# EasyEDA Pro project ch552gv1.eprj

# Schematic CH552GV1
Create Date: 2023-10-27; Page Name: CH552GV1; Project Name: ch552gv1; Schematic Name: CH552GV1; Update Date: 2024-03-25; Company: 嘉立创EDA; Page Size: A4; Version: V1.0
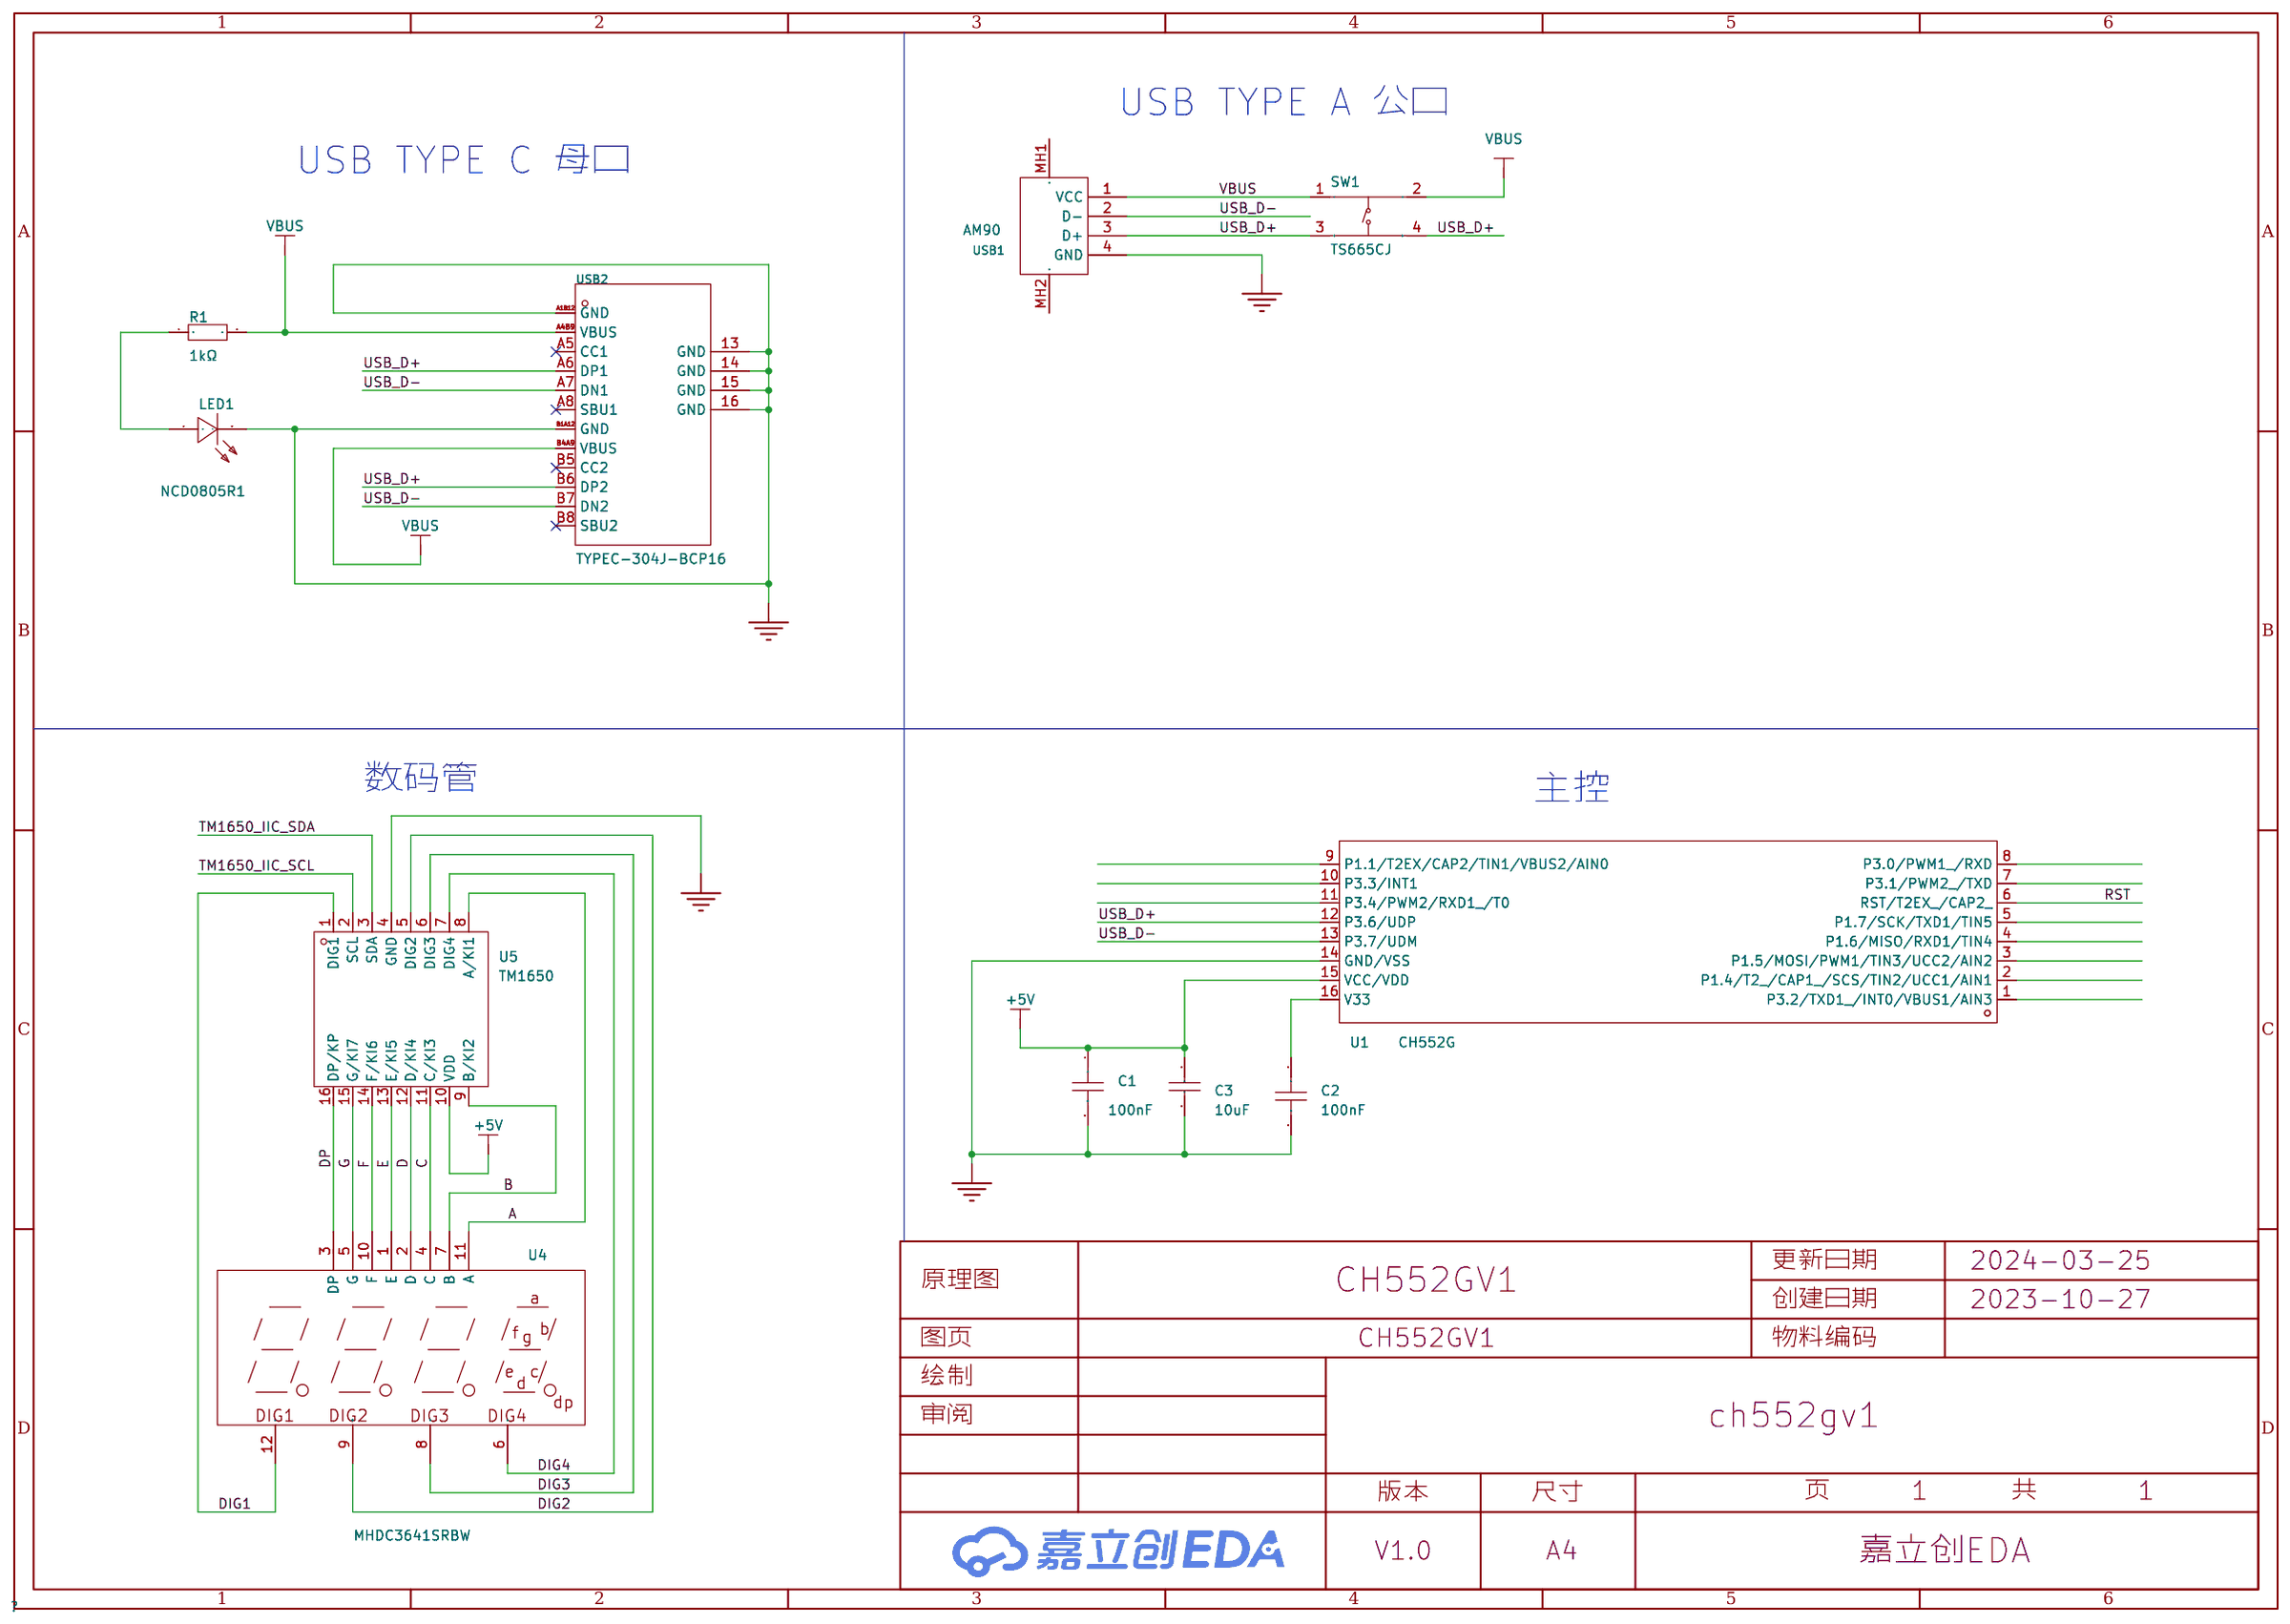
[diagram p0: schematic sheet]

## Parts
C1  100nF  [C0603]
C2  100nF  [C0603]
C3  10uF  [C1206]
LED1  NCD0805R1  [LED0805-R-RD]
R1  1kΩ  [R0603]
SW1  TS665CJ  [SW-TH_4P-L6.0-W6.0-P4.50-LS6.5]
U1  CH552G  [SOP-16_L10.0-W3.9-P1.27-LS6.0-BL]
U4  MHDC3641SRBW  [LED-SEG-TH_12P-L30.0-W14.0-P2.54-LS10.2]
U5  TM1650  [SOP-16_L10.0-W3.9-P1.27-LS6.0-BL]
USB1  AM90  [USB-AM-TH_AM90]
USB2  TYPEC-304J-BCP16  [USB-C-SMD_TYPEC-304J-BCP16]

## Library data of the parts
C1 C2 = CC0603KRX7R9BB104: 容值:100nF;精度:±10%;额定电压:50V;材质(温度系数):X7R;; LCSC Part Name: 100nF ±10% 50V; Supplier Part: C14663; Manufacturer: YAGEO(国巨); Supplier Footprint: 0603; JLCPCB Part Class: 基础库; Datasheet: https://atta.szlcsc.com/upload/public/pdf/source/20180910/C282072_33301C7F631E79921B82A8DAC6BCC5B3.pdf; Supplier: LCSC; Tolerance: ±10%; Voltage Rated: 50V; Temperature Coefficient: X7R
C3 = CL31A106KAHNNNE: 容值:10uF;精度:±10%;额定电压:25V;材质(温度系数):X5R;; LCSC Part Name: 10uF ±10% 25V; Supplier Part: C9807; Manufacturer: SAMSUNG(三星); Supplier Footprint: 1206; JLCPCB Part Class: 扩展库; Datasheet: https://atta.szlcsc.com/upload/public/pdf/source/20160218/1457707763339.pdf; Supplier: LCSC; Tolerance: ±10%; Voltage Rated: 25V; Temperature Coefficient: X5R
LED1 = NCD0805R1: 灯头类型:-;发光颜色:红色;正向电压(VF):1.6V~2.6V;功率:65mW;正向电流:20mA;主波长:615nm~630nm;二极管配置:独立二极管;透镜颜色:无色透明透镜;色温:-;发光强度:67mcd~195mcd;发光角度:130°;载带方式:-;工作温度:-30℃~+85℃;; Supplier Part: C84256; Manufacturer: 国星光电; Supplier Footprint: 0805; JLCPCB Part Class: 基础库; Datasheet: https://atta.szlcsc.com/upload/public/pdf/source/20200820/C84256_F0A75A43B3EAD75808600A0514C76B99.pdf; Supplier: LCSC; Emitted Color: 红色; Forward Voltage (VF): 1.6V~2.6V; Power Dissipation: 65mW; Forward Current: 20mA; Dominant Wavelength: 615nm~630nm; Diode Configuration: 独立二极管; Lens Color: 无色透明透镜; Luminous Intensity: 67mcd~195mcd; Viewing Angle: 130°; Operating Temperature: -30℃~+85℃
R1 = 0603WAF1001T5E: 电阻类型:厚膜电阻;阻值:1kΩ;精度:±1%;功率:100mW;最大工作电压:75V;温度系数:±100ppm/℃;; LCSC Part Name: 1kΩ ±1% 100mW 厚膜电阻; Supplier Part: C21190; Manufacturer: UNI-ROYAL(厚声); Supplier Footprint: 0603; JLCPCB Part Class: 基础库; Datasheet: https://atta.szlcsc.com/upload/public/pdf/source/20200306/C422600_1E6D84923E4A46A82E41ADD87F860B5C.pdf; Supplier: LCSC; Type: 厚膜电阻; Tolerance: ±1%; Power(Watts): 100mW; Overload Voltage (Max): 75V; Temperature Coefficient: ±100ppm/℃; Operating Temperature Range: -55℃~+155℃
SW1 = TS665CJ: 触点电流:50mA;额定电压(DC):12V;电路结构:单刀单掷;安装方式:直插;带灯:-;机械寿命:-;; LCSC Part Name: 6*6*5mm 直插 轻触开关; Supplier Part: C393938; Manufacturer: SHOU HAN(首韩); Supplier Footprint: 插件; JLCPCB Part Class: 扩展库; Datasheet: https://atta.szlcsc.com/upload/public/pdf/source/20190521/C393938_BDABEAC600B4C55E200A80AA129B70BC.pdf; Supplier: LCSC; Contact Current: 50mA; Voltage Rating (DC): 12V; Circuit: 单刀单掷; Mounting Style: 直插; Actuator Style: 圆形按钮; Switch Length: 6mm; Switch Width: 6mm; Switch Height: 5mm
U1 = CH552G: CPU内核:51系列;CPU最大主频:24MHz;工作电压范围:3.3V~5V;程序存储容量:16KB;程序存储器类型:FLASH;RAM总容量:1.25KB;GPIO端口数量:-;; Supplier Part: C111292; Manufacturer: WCH(南京沁恒); Supplier Footprint: SOP-16; JLCPCB Part Class: 扩展库; Datasheet: https://atta.szlcsc.com/upload/public/pdf/source/20200819/C111292_2988E0DDEDF937C7B5A075A68BF2AC9C.pdf; Supplier: LCSC; CPU Core: 51系列; CPU Maximum Speed: 24MHz; Operating Voltage Range: 3.3V~5V; Program Storage Size: 16KB; Program Memory Type: FLASH; RAM Size: 1.25KB; ADC (Bit): 8bit; PWM (Bit): 8bit; 16Bit Timer: 3; UART/USART: 2; SPI: 1; Universal Serial Bus: 有; Peripheral/Function: DMA；看门狗；CCP捕获/比较；触控按键; Watchdog: 有; CCP Capture/Compare: 有; Direct Memory Access: 有; Internal Oscillator: 有; Operating Temperature Range: -40℃~+85℃
U4 = MHDC3641SRBW: 数码管位数:4位;功耗:50mW;发光颜色:红色;LED极性:共阴极;数字/字母大小(英寸):0.362;; LCSC Part Name: 0.36共阴四八红色数码管; Supplier Part: C3291494; Manufacturer: MEIHUA(美华); Supplier Footprint: 插件; JLCPCB Part Class: 扩展库; Datasheet: https://atta.szlcsc.com/upload/public/pdf/source/20220627/BF0C2CD628B0CAC5A0500BAA2D144DD2.pdf; Supplier: LCSC; Number of Characters: 4位; Module Size: 30.0mmx14mmx7.2mm; Power Dissipation: 50mW; Luminous Color: 红色; LED Polarity: 共阴极; Digit/Alpha Size(inch): 0.362
U5 = TM1650: 晶圆版本是TA1809B; LCSC Part Name: 晶圆版本是TA1809B; Supplier Part: C2685241; Manufacturer: TM(天微); Supplier Footprint: SOP-16; JLCPCB Part Class: 扩展库; Datasheet: https://atta.szlcsc.com/upload/public/pdf/source/20210512/C2685241_0A1DB6924EEA12E8A785A705958A55DE.pdf; Supplier: LCSC
USB1 = AM90: 连接器类型:Type-A;标准:USB 2.0;公母:公头;触点数量:4P;端口数量:1;安装方式:弯插;额定电流 - 电源:-;工作温度范围:-;; LCSC Part Name: Type-A 公头 弯插 白胶有柱 直边; Supplier Part: C404965; Manufacturer: SHOU HAN(首韩); Supplier Footprint: 插件; JLCPCB Part Class: 扩展库; Datasheet: https://atta.szlcsc.com/upload/public/pdf/source/20190722/C404965_9CC10BE28E3F9E5134758D030387C529.pdf; Supplier: LCSC; Connector Type: Type-A; Standard: USB 2.0; Gender: 公头; Number of Contacts: 4P; Number of Ports: 1; Mounting Style: 弯插
USB2 = TYPEC-304J-BCP16: 连接器类型:Type-C;标准:USB 3.1;公母:母座;触点数量:16;端口数量:1;安装方式:卧贴;额定电流 - 电源:5A;工作温度范围:-40℃~+85℃;焊接温度(最大值):260℃;; LCSC Part Name: Type-C 母座 卧贴 脚长2.0; Supplier Part: C2835315; Manufacturer: XUNPU(讯普); Supplier Footprint: SMD,8.94x7.35x3.16mm; JLCPCB Part Class: 扩展库; Datasheet: https://atta.szlcsc.com/upload/public/pdf/source/20210528/C2835315_A76BD3CF9329D12B6041421AD23BFD66.pdf; Supplier: LCSC; Connector Type: Type-C; Standard: USB 3.1; Gender: 母座; Number of Ports: 1; Number of Contacts: 16; Mounting Style: 卧贴; Current Rating - Power (Max): 5A; Operating Temperature Range: -40℃~+85℃; Soldering Temperature(Max): 260℃; Welding Temperature (Max): 260℃

## Nets
+5V: C1.1 C3.1 U1.15(VCC/VDD) U5.10(VDD)
GND: C1.2 C2.2 C3.2 LED1.2(-) U1.14(GND/VSS) U5.4(GND) USB1.4(GND) USB2.13(GND) USB2.14(GND) USB2.15(GND) USB2.16(GND) USB2.A1B12(GND) USB2.B1A12(GND)
VBUS: R1.2 SW1.1(A) SW1.2(B) USB1.1(VCC) USB2.A4B9(VBUS) USB2.B4A9(VBUS)
A: U4.11(A) U5.8(A/KI1)
B: U4.7(B) U5.9(B/KI2)
C: U4.4(C) U5.11(C/KI3)
D: U4.2(D) U5.12(D/KI4)
DIG1: U4.12(DIG1) U5.1(DIG1)
DIG2: U4.9(DIG2) U5.5(DIG2)
DIG3: U4.8(DIG3) U5.6(DIG3)
DIG4: U4.6(DIG4) U5.7(DIG4)
DP: U4.3(DP) U5.16(DP/KP)
E: U4.1(E) U5.13(E/KI5)
F: U4.10(F) U5.14(F/KI6)
G: U4.5(G) U5.15(G/KI7)
RST: U1.6(RST/T2EX_/CAP2_)
TM1650_IIC_SCL: U5.2(SCL)
TM1650_IIC_SDA: U5.3(SDA)
USB_D+: SW1.3(C) SW1.4(D) U1.12(P3.6/UDP) USB1.3(D+) USB2.A6(DP1) USB2.B6(DP2)
USB_D-: U1.13(P3.7/UDM) USB1.2(D-) USB2.A7(DN1) USB2.B7(DN2)
$1N1756: LED1.1(+) R1.1
Net-(C2-1): C2.1 U1.16(V33)

Not connected (* = marked no-connect by the designer): U1 1(P3.2/TXD1_/INT0/VBUS1/AIN3) 2(P1.4/T2_/CAP1_/SCS/TIN2/UCC1/AIN1) 3(P1.5/MOSI/PWM1/TIN3/UCC2/AIN2) 4(P1.6/MISO/RXD1/TIN4) 5(P1.7/SCK/TXD1/TIN5) 7(P3.1/PWM2_/TXD) 8(P3.0/PWM1_/RXD) 9(P1.1/T2EX/CAP2/TIN1/VBUS2/AIN0) 10(P3.3/INT1) 11(P3.4/PWM2/RXD1_/T0); USB1 MH1 MH2; USB2 A5(CC1)* A8(SBU1)* B5(CC2)* B8(SBU2)*

## Notes on the sheet
- USB TYPE A 公口
- USB TYPE C 母口
- 数码管
- 主控

# Schematic CH552GV2
Create Date: 2024-03-15; Page Name: P1; Project Name: ch552gv1; Schematic Name: CH552GV2; Update Date: 2024-03-18; Company: 嘉立创EDA; Page Size: A4; Version: V1.0
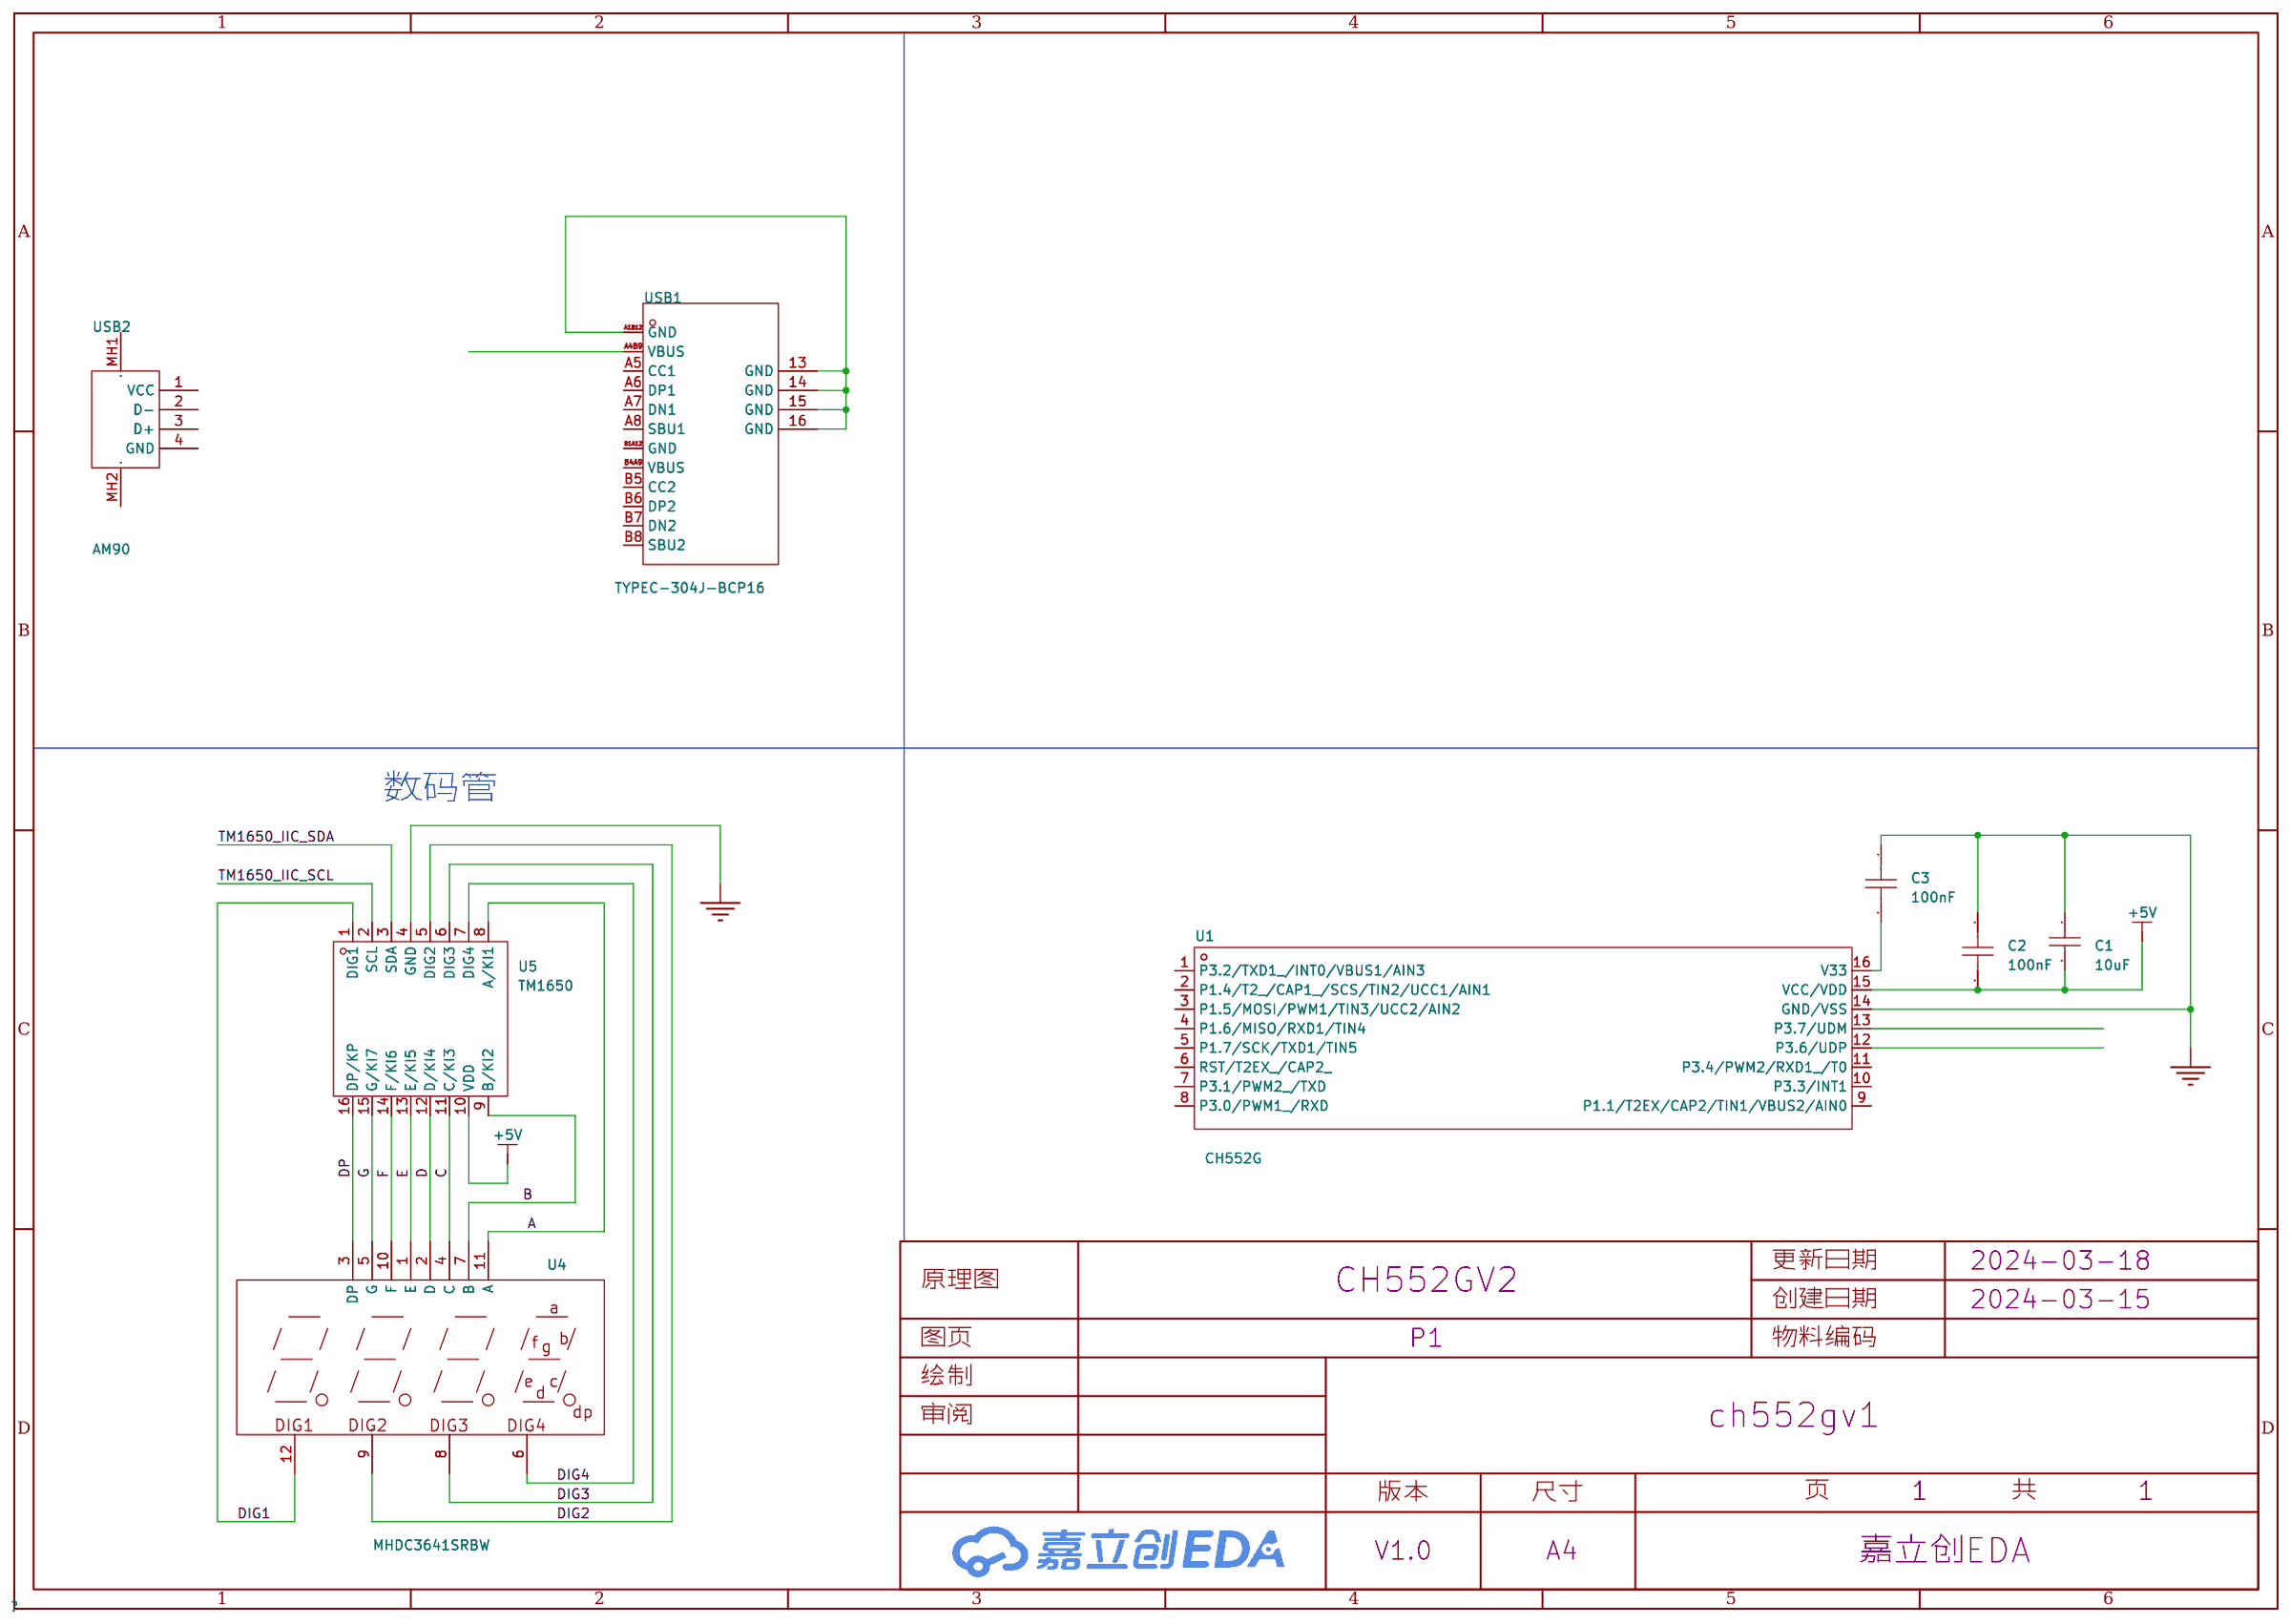
[diagram p1: schematic sheet]

## Parts
C1  10uF  [C1206]
C2  100nF  [C0603]
C3  100nF  [C0603]
U1  CH552G  [SOP-16_L10.0-W3.9-P1.27-LS6.0-BL]
U4  MHDC3641SRBW  [LED-SEG-TH_12P-L30.0-W14.0-P2.54-LS10.2]
U5  TM1650  [SOP-16_L10.0-W3.9-P1.27-LS6.0-BL]
USB1  TYPEC-304J-BCP16  [USB-C-SMD_TYPEC-304J-BCP16]
USB2  AM90  [USB-AM-TH_AM90]

## Library data of the parts
C1 = CL31A106KAHNNNE: 容值:10uF;精度:±10%;额定电压:25V;材质(温度系数):X5R;; LCSC Part Name: 10uF ±10% 25V; Supplier Part: C9807; Manufacturer: SAMSUNG(三星); Supplier Footprint: 1206; JLCPCB Part Class: 扩展库; Datasheet: https://atta.szlcsc.com/upload/public/pdf/source/20160218/1457707763339.pdf; Supplier: LCSC; Tolerance: ±10%; Voltage Rated: 25V; Temperature Coefficient: X5R
C2 C3 = CC0603KRX7R9BB104: 容值:100nF;精度:±10%;额定电压:50V;材质(温度系数):X7R;; LCSC Part Name: 100nF ±10% 50V; Supplier Part: C14663; Manufacturer: YAGEO(国巨); Supplier Footprint: 0603; JLCPCB Part Class: 基础库; Datasheet: https://atta.szlcsc.com/upload/public/pdf/source/20180910/C282072_33301C7F631E79921B82A8DAC6BCC5B3.pdf; Supplier: LCSC; Tolerance: ±10%; Voltage Rated: 50V; Temperature Coefficient: X7R
U1 = CH552G: CPU内核:51系列;CPU最大主频:24MHz;工作电压范围:3.3V~5V;程序存储容量:16KB;程序存储器类型:FLASH;RAM总容量:1.25KB;GPIO端口数量:-;; Supplier Part: C111292; Manufacturer: WCH(南京沁恒); Supplier Footprint: SOP-16; JLCPCB Part Class: 扩展库; Datasheet: https://atta.szlcsc.com/upload/public/pdf/source/20200819/C111292_2988E0DDEDF937C7B5A075A68BF2AC9C.pdf; Supplier: LCSC; CPU Core: 51系列; CPU Maximum Speed: 24MHz; Operating Voltage Range: 3.3V~5V; Program Storage Size: 16KB; Program Memory Type: FLASH; RAM Size: 1.25KB; ADC (Bit): 8bit; PWM (Bit): 8bit; 16Bit Timer: 3; UART/USART: 2; SPI: 1; Universal Serial Bus: 有; Peripheral/Function: DMA；看门狗；CCP捕获/比较；触控按键; Watchdog: 有; CCP Capture/Compare: 有; Direct Memory Access: 有; Internal Oscillator: 有; Operating Temperature Range: -40℃~+85℃
U4 = MHDC3641SRBW: 数码管位数:4位;功耗:50mW;发光颜色:红色;LED极性:共阴极;数字/字母大小(英寸):0.362;; LCSC Part Name: 0.36共阴四八红色数码管; Supplier Part: C3291494; Manufacturer: MEIHUA(美华); Supplier Footprint: 插件; JLCPCB Part Class: 扩展库; Datasheet: https://atta.szlcsc.com/upload/public/pdf/source/20220627/BF0C2CD628B0CAC5A0500BAA2D144DD2.pdf; Supplier: LCSC; Number of Characters: 4位; Module Size: 30.0mmx14mmx7.2mm; Power Dissipation: 50mW; Luminous Color: 红色; LED Polarity: 共阴极; Digit/Alpha Size(inch): 0.362
U5 = TM1650: 晶圆版本是TA1809B; LCSC Part Name: 晶圆版本是TA1809B; Supplier Part: C2685241; Manufacturer: TM(天微); Supplier Footprint: SOP-16; JLCPCB Part Class: 扩展库; Datasheet: https://atta.szlcsc.com/upload/public/pdf/source/20210512/C2685241_0A1DB6924EEA12E8A785A705958A55DE.pdf; Supplier: LCSC
USB1 = TYPEC-304J-BCP16: 连接器类型:Type-C;标准:USB 3.1;公母:母;端口数量:1;触点数量:16P;安装方式:卧贴;额定电流 - 电源:5A;工作温度范围:-40℃~+85℃;焊接温度(最大值):260℃;; LCSC Part Name: Type-C 母 卧贴; Supplier Part: C2835315; Manufacturer: XUNPU(讯普); Supplier Footprint: SMD; JLCPCB Part Class: 扩展库; Datasheet: https://atta.szlcsc.com/upload/public/pdf/source/20210528/C2835315_A76BD3CF9329D12B6041421AD23BFD66.pdf; Supplier: LCSC; Connector Type: Type-C; Standard: USB 3.1; Gender: 母; Number of Ports: 1; Number of Contacts: 16P; Mounting Style: 卧贴; Current Rating - Power (Max): 5A; Operating Temperature Range: -40℃~+85℃; Soldering Temperature(Max): 260℃
USB2 = AM90: 连接器类型:Type-A;标准:USB 2.0;公母:公头;触点数量:4P;端口数量:1;安装方式:弯插;额定电流 - 电源:-;工作温度范围:-;; LCSC Part Name: Type-A 公头 弯插 白胶有柱 直边; Supplier Part: C404965; Manufacturer: SHOU HAN(首韩); Supplier Footprint: 插件; JLCPCB Part Class: 扩展库; Datasheet: https://atta.szlcsc.com/upload/public/pdf/source/20190722/C404965_9CC10BE28E3F9E5134758D030387C529.pdf; Supplier: LCSC; Connector Type: Type-A; Standard: USB 2.0; Gender: 公头; Number of Contacts: 4P; Number of Ports: 1; Mounting Style: 弯插

## Nets
+5V: C1.2 C2.2 U1.15(VCC/VDD) U5.10(VDD)
GND: C1.1 C2.1 C3.1 U1.14(GND/VSS) U5.4(GND)
A: U4.11(A) U5.8(A/KI1)
B: U4.7(B) U5.9(B/KI2)
C: U4.4(C) U5.11(C/KI3)
D: U4.2(D) U5.12(D/KI4)
DIG1: U4.12(DIG1) U5.1(DIG1)
DIG2: U4.9(DIG2) U5.5(DIG2)
DIG3: U4.8(DIG3) U5.6(DIG3)
DIG4: U4.6(DIG4) U5.7(DIG4)
DP: U4.3(DP) U5.16(DP/KP)
E: U4.1(E) U5.13(E/KI5)
F: U4.10(F) U5.14(F/KI6)
G: U4.5(G) U5.15(G/KI7)
TM1650_IIC_SCL: U5.2(SCL)
TM1650_IIC_SDA: U5.3(SDA)
Net-(C3-2): C3.2 U1.16(V33)
Net-(USB1-13): USB1.13(GND) USB1.14(GND) USB1.15(GND) USB1.16(GND) USB1.A1B12(GND)

Not connected (* = marked no-connect by the designer): U1 1(P3.2/TXD1_/INT0/VBUS1/AIN3) 2(P1.4/T2_/CAP1_/SCS/TIN2/UCC1/AIN1) 3(P1.5/MOSI/PWM1/TIN3/UCC2/AIN2) 4(P1.6/MISO/RXD1/TIN4) 5(P1.7/SCK/TXD1/TIN5) 6(RST/T2EX_/CAP2_) 7(P3.1/PWM2_/TXD) 8(P3.0/PWM1_/RXD) 9(P1.1/T2EX/CAP2/TIN1/VBUS2/AIN0) 10(P3.3/INT1) 11(P3.4/PWM2/RXD1_/T0) 12(P3.6/UDP) 13(P3.7/UDM); USB1 A4B9(VBUS) A5(CC1) A6(DP1) A7(DN1) A8(SBU1) B1A12(GND) B4A9(VBUS) B5(CC2) B6(DP2) B7(DN2) B8(SBU2); USB2 1(VCC) 2(D-) 3(D+) 4(GND) MH1 MH2

## Notes on the sheet
- 数码管

# Schematic CH552TV1
Create Date: 2024-03-15; Page Name: P1; Project Name: ch552gv1; Schematic Name: CH552TV1; Update Date: 2024-03-16; Company: 嘉立创EDA; Page Size: A4; Version: V1.0
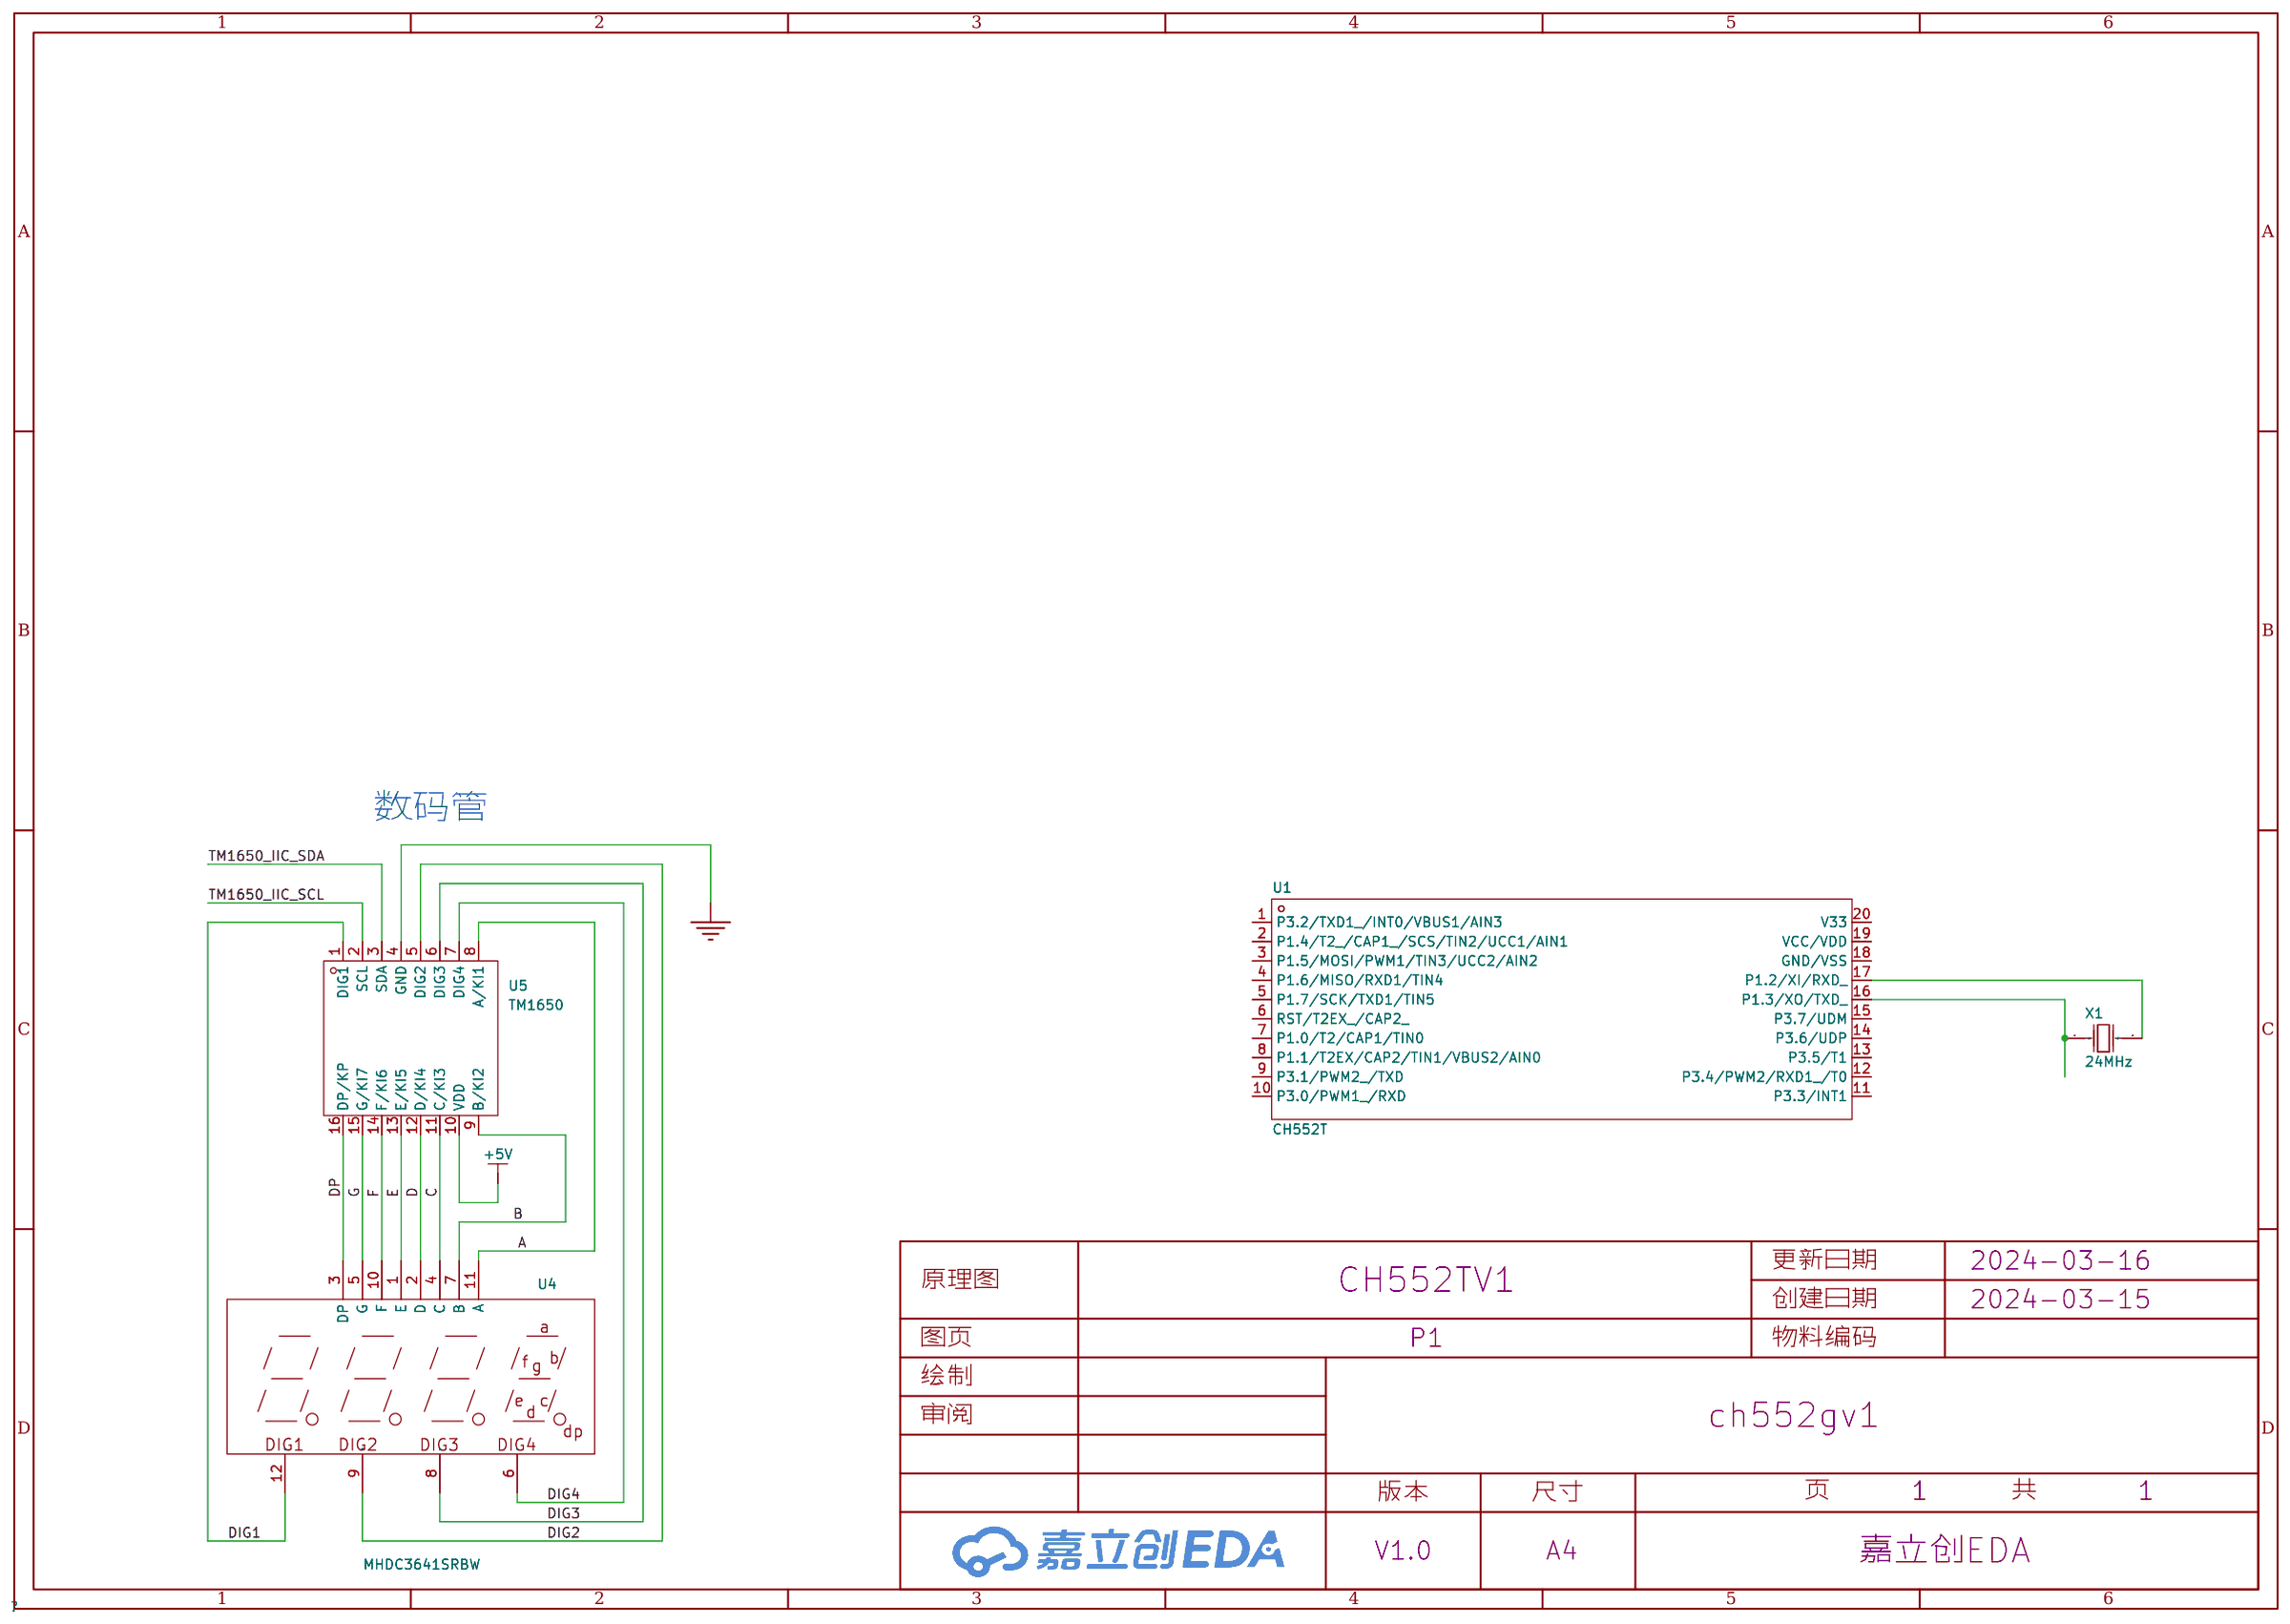
[diagram p2: schematic sheet]

## Parts
U1  CH552T  [TSSOP-20_L6.5-W4.4-P0.65-LS6.4-BL]
U4  MHDC3641SRBW  [LED-SEG-TH_12P-L30.0-W14.0-P2.54-LS10.2]
U5  TM1650  [SOP-16_L10.0-W3.9-P1.27-LS6.0-BL]
X1  24MHz  [HC-49S_L11.4-W4.8]

## Library data of the parts
U1 = CH552T: 应用功能:-;接口协议:-;; Supplier Part: C111367; Manufacturer: WCH(南京沁恒); Supplier Footprint: TSSOP-20; JLCPCB Part Class: 扩展库; Datasheet: https://atta.szlcsc.com/upload/public/pdf/source/20200819/C111367_8DB5755A3F0C96025C1473BE9B2CF47E.pdf; Supplier: LCSC
U4 = MHDC3641SRBW: 数码管位数:4位;功耗:50mW;发光颜色:红色;LED极性:共阴极;数字/字母大小(英寸):0.362;; LCSC Part Name: 0.36共阴四八红色数码管; Supplier Part: C3291494; Manufacturer: MEIHUA(美华); Supplier Footprint: 插件; JLCPCB Part Class: 扩展库; Datasheet: https://atta.szlcsc.com/upload/public/pdf/source/20220627/BF0C2CD628B0CAC5A0500BAA2D144DD2.pdf; Supplier: LCSC; Number of Characters: 4位; Module Size: 30.0mmx14mmx7.2mm; Power Dissipation: 50mW; Luminous Color: 红色; LED Polarity: 共阴极; Digit/Alpha Size(inch): 0.362
U5 = TM1650: 晶圆版本是TA1809B; LCSC Part Name: 晶圆版本是TA1809B; Supplier Part: C2685241; Manufacturer: TM(天微); Supplier Footprint: SOP-16; JLCPCB Part Class: 扩展库; Datasheet: https://atta.szlcsc.com/upload/public/pdf/source/20210512/C2685241_0A1DB6924EEA12E8A785A705958A55DE.pdf; Supplier: LCSC
X1 = X49SM24MSD2SC: 晶振类型:贴片晶振;频率:24MHz;常温频差:±20ppm;外接负载电容:20pF;频率稳定度(全温):±30ppm;; LCSC Part Name: 24MHz ±20ppm 20pF; Supplier Part: C2253; Manufacturer: YXC(扬兴晶振); Supplier Footprint: HC-49S-SMD; JLCPCB Part Class: 扩展库; Datasheet: https://atta.szlcsc.com/upload/public/pdf/source/20210329/C106809_0E91E60850A780B284B63D653DC40EA4.pdf; Supplier: LCSC; Crystal Type: 贴片晶振; Normal temperature Frequency Tolerance: ±20ppm; External load capacitor: 20pF; Frequency Stability(Full temperature range): ±30ppm; Operating Temperature: -20℃~+70℃

## Nets
+5V: U5.10(VDD)
GND: U5.4(GND)
A: U4.11(A) U5.8(A/KI1)
B: U4.7(B) U5.9(B/KI2)
C: U4.4(C) U5.11(C/KI3)
D: U4.2(D) U5.12(D/KI4)
DIG1: U4.12(DIG1) U5.1(DIG1)
DIG2: U4.9(DIG2) U5.5(DIG2)
DIG3: U4.8(DIG3) U5.6(DIG3)
DIG4: U4.6(DIG4) U5.7(DIG4)
DP: U4.3(DP) U5.16(DP/KP)
E: U4.1(E) U5.13(E/KI5)
F: U4.10(F) U5.14(F/KI6)
G: U4.5(G) U5.15(G/KI7)
TM1650_IIC_SCL: U5.2(SCL)
TM1650_IIC_SDA: U5.3(SDA)
Net-(U1-16): U1.16(P1.3/XO/TXD_) X1.1(OSC1)
Net-(U1-17): U1.17(P1.2/XI/RXD_) X1.2(OSC2)

Not connected (* = marked no-connect by the designer): U1 1(P3.2/TXD1_/INT0/VBUS1/AIN3) 2(P1.4/T2_/CAP1_/SCS/TIN2/UCC1/AIN1) 3(P1.5/MOSI/PWM1/TIN3/UCC2/AIN2) 4(P1.6/MISO/RXD1/TIN4) 5(P1.7/SCK/TXD1/TIN5) 6(RST/T2EX_/CAP2_) 7(P1.0/T2/CAP1/TIN0) 8(P1.1/T2EX/CAP2/TIN1/VBUS2/AIN0) 9(P3.1/PWM2_/TXD) 10(P3.0/PWM1_/RXD) 11(P3.3/INT1) 12(P3.4/PWM2/RXD1_/T0) 13(P3.5/T1) 14(P3.6/UDP) 15(P3.7/UDM) 18(GND/VSS) 19(VCC/VDD) 20(V33)

## Notes on the sheet
- 数码管

# Board CH552GV1
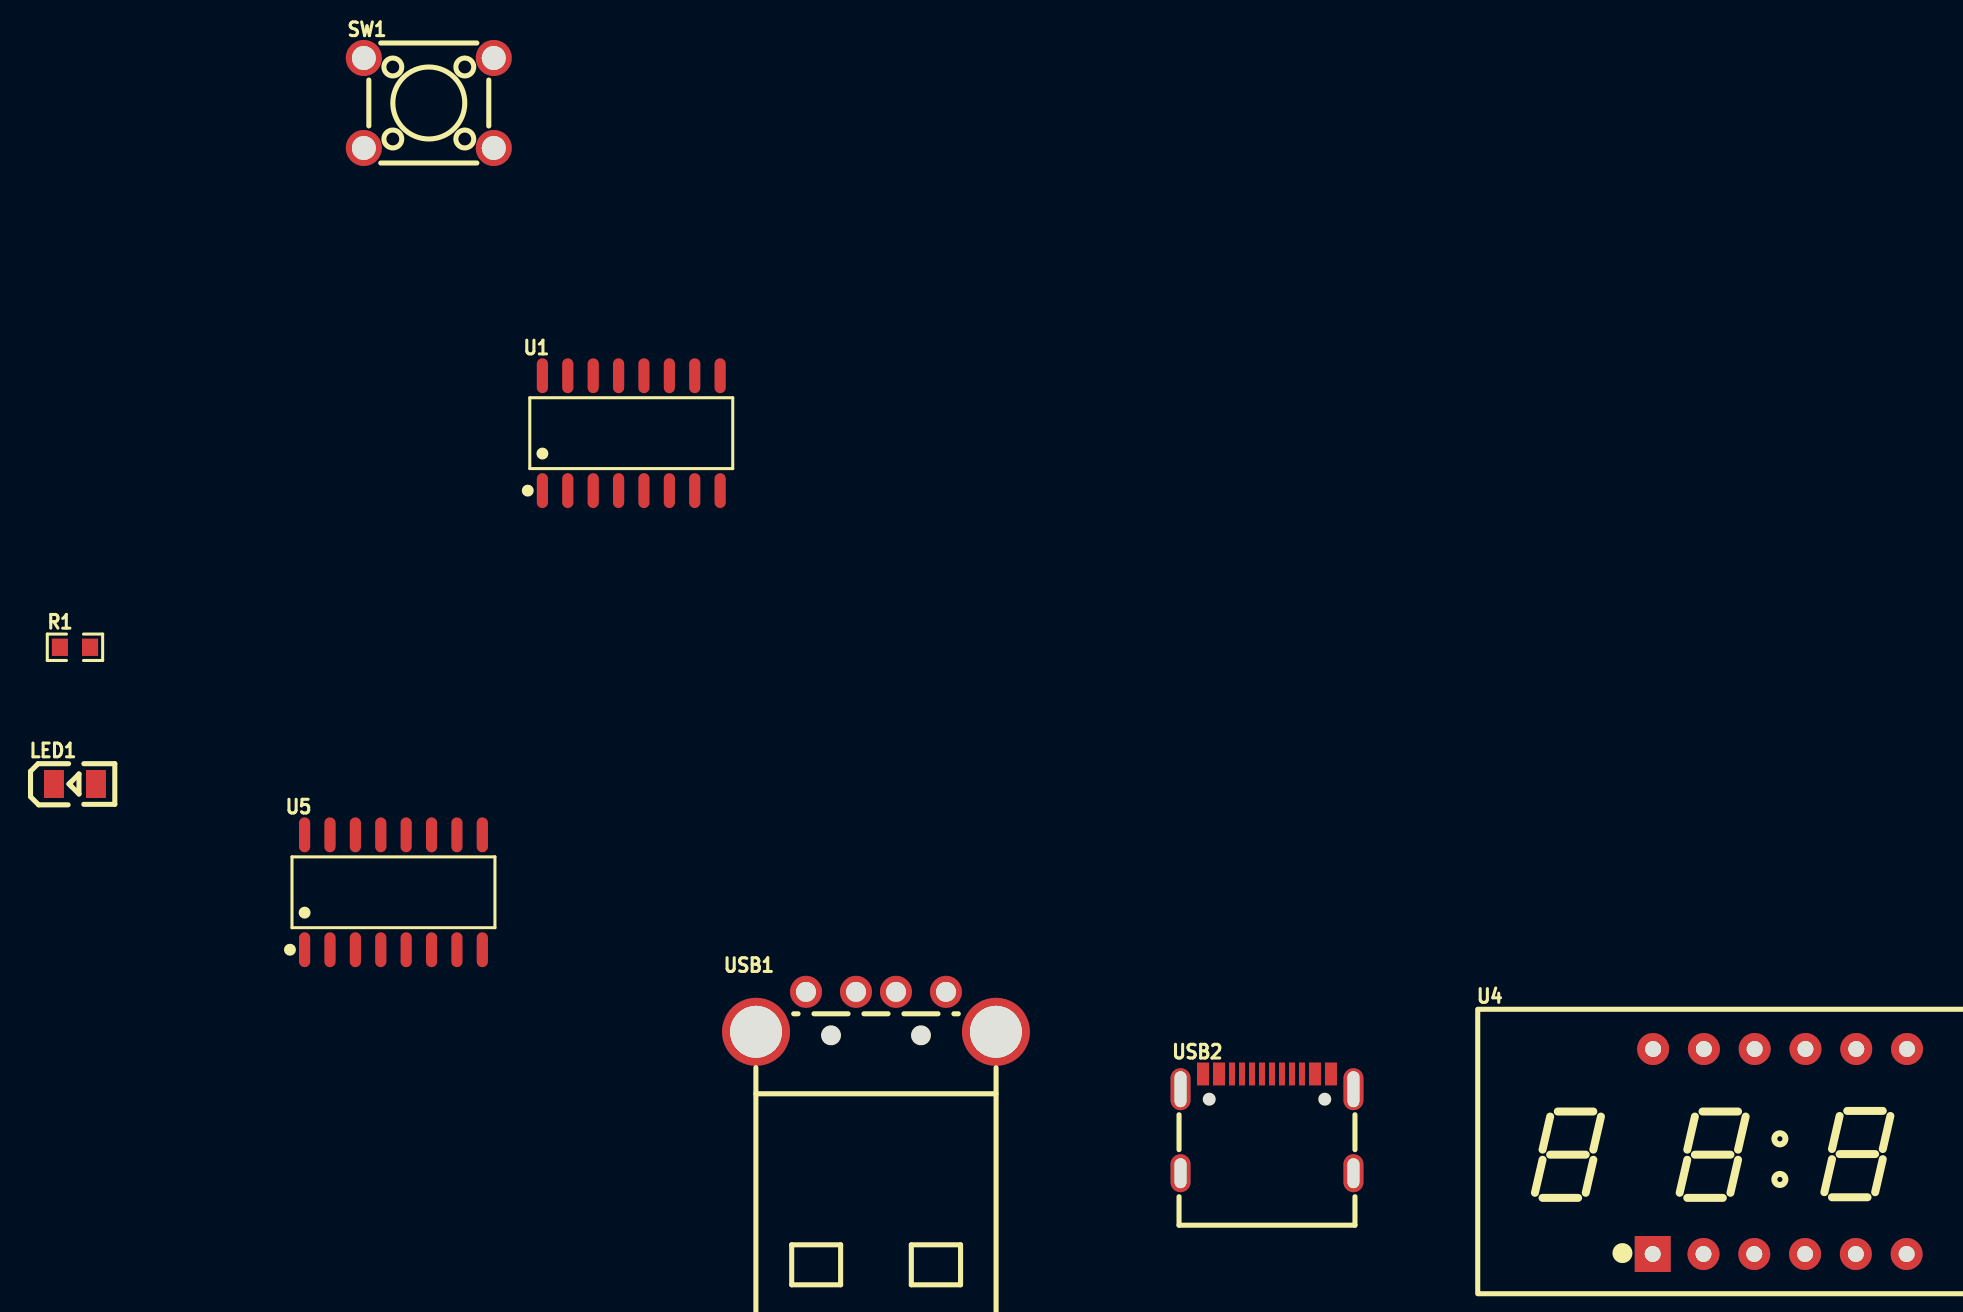
[diagram p3: board, top side]
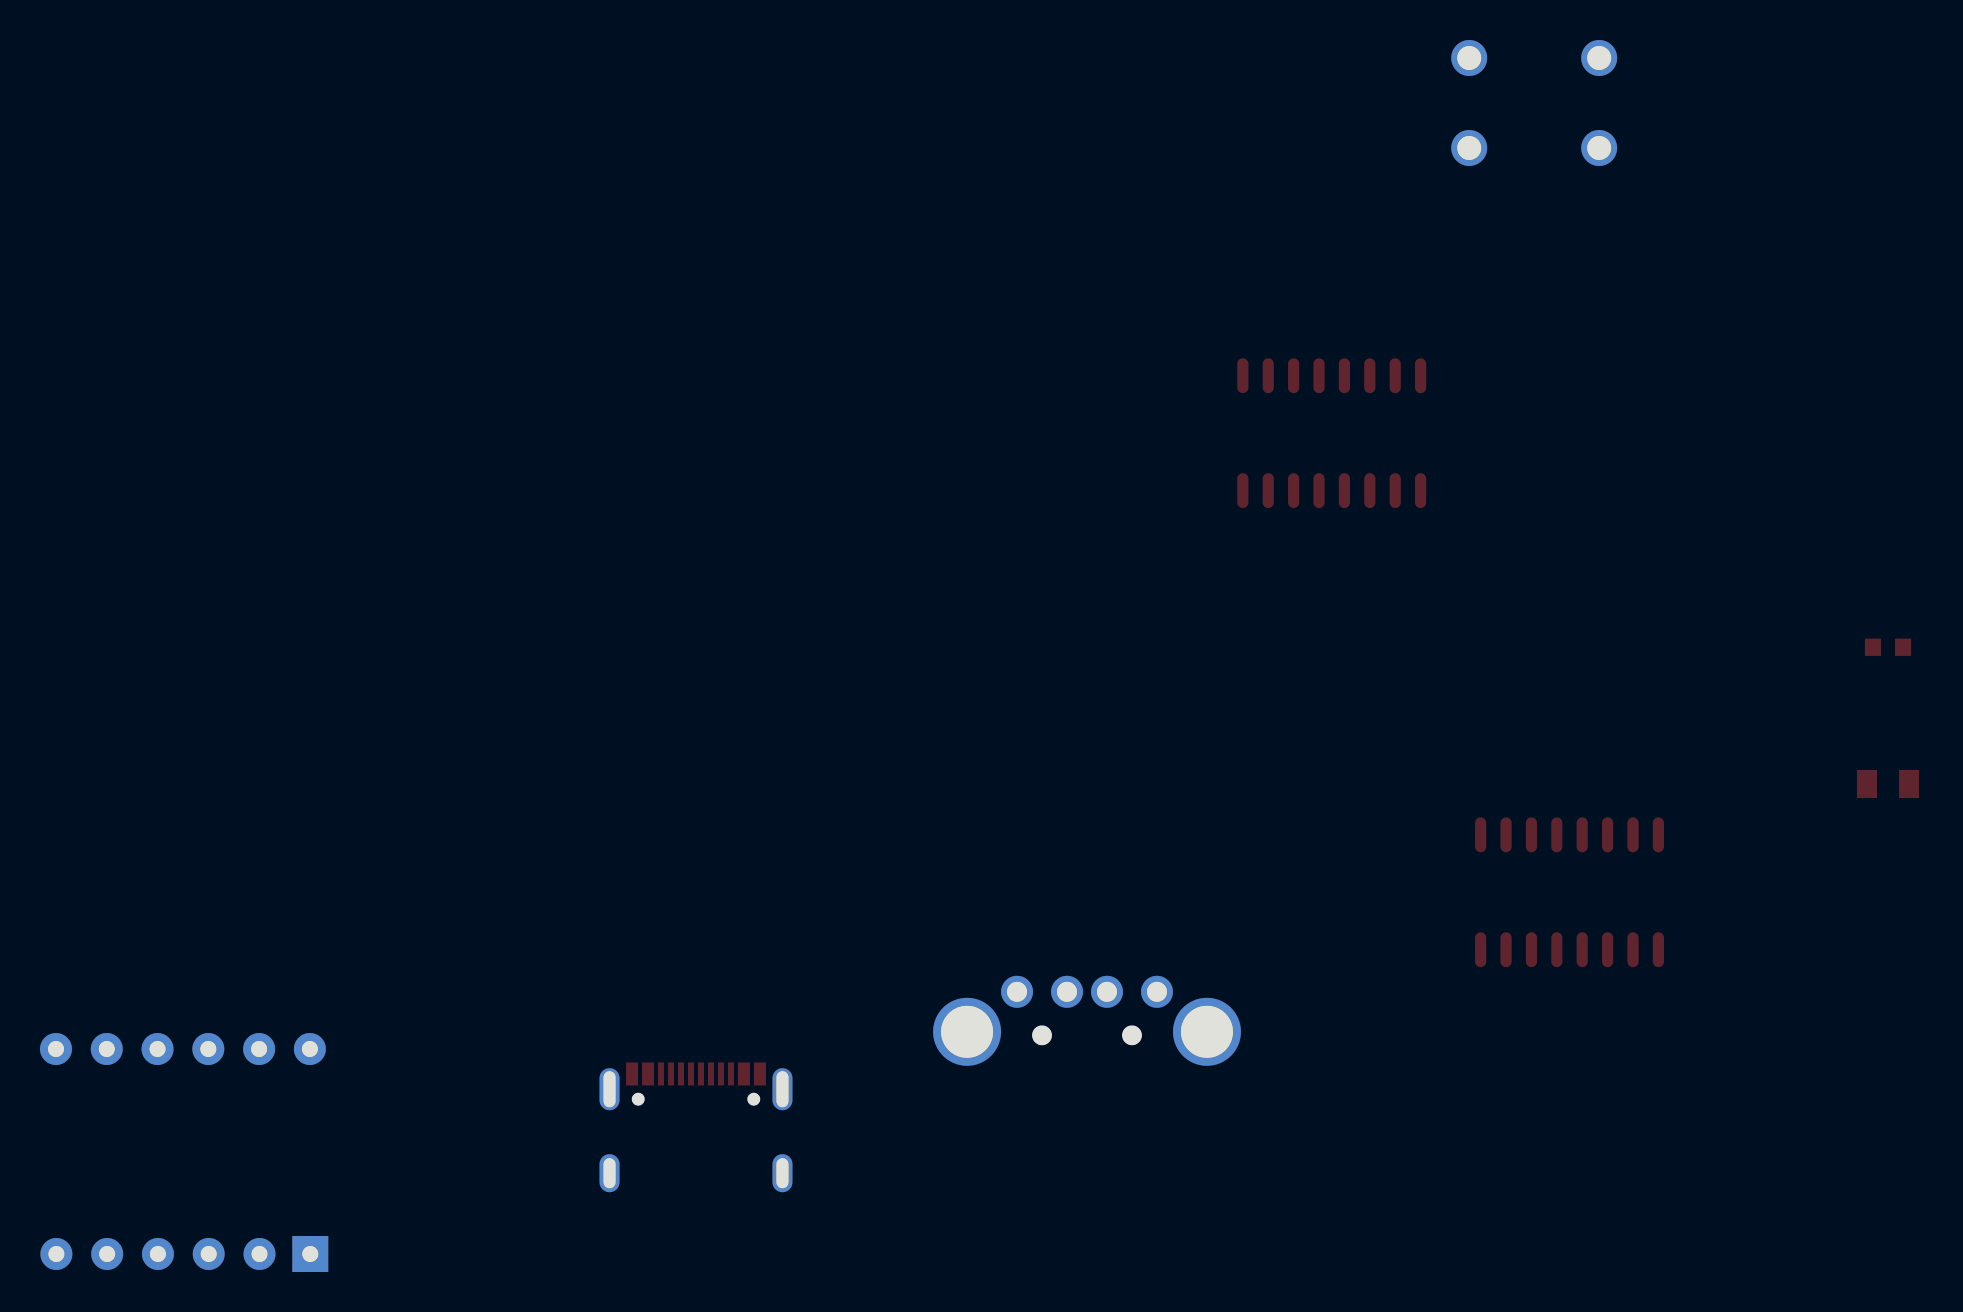
[diagram p4: board, bottom side, seen from below]

Outline 25.52 x 4.01 mm; copper layers: Top Layer, Bottom Layer. Coordinates in mm from the lower left corner of the outline.
Stack: Top Layer 0.035mm / Dielectric1 1.51mm FR4 er 4.5 / Bottom Layer 0.035mm

## Design rules (mm)
template: JLCPCB Capability(Two Layers Board)
spacing copperThickness1oz (default): track to track 0.102, other pairs 0.152 to 0.3
spacing copperThickness2oz: track to track 0.203, other pairs 0.152 to 0.3
track width copperThickness1oz (default): min 0.127, default 0.254, max 2.54
track width copperThickness2oz: min 0.203, default 0.254, max 2.54
differential pair differentialPair (default): width min 0.127, default 0.254, max 2.54; gap min 0.152, default 0.152
via viaSize (default): diameter min 0.5, default 0.61, max 10; hole min 0.3, default 0.305, max 6.3

## Placement (name value [footprint] x y rotation side)
LED1  NCD0805R1  [LED0805-R-RD]  -37.32 16.08 0 top
R1  1kΩ  [R0603]  -37.32 22.92 0 top
SW1  TS665CJ  [SW-TH_4P-L6.0-W6.0-P4.50-LS6.5]  -19.62 50.14 0 top
U1  CH552G  [SOP-16_L10.0-W3.9-P1.27-LS6.0-BL]  -9.5 33.63 0 top
U4  MHDC3641SRBW  [LED-SEG-TH_12P-L30.0-W14.0-P2.54-LS10.2]  47.96 -2.29 0 top
U5  TM1650  [SOP-16_L10.0-W3.9-P1.27-LS6.0-BL]  -21.39 10.67 0 top
USB1  AM90  [USB-AM-TH_AM90]  2.75 4.69 0 top
USB2  TYPEC-304J-BCP16  [USB-C-SMD_TYPEC-304J-BCP16]  22.3 -0.9 0 top

## Footprints (pads in the part's own frame, mm; a bottom-side part is the same pattern mirrored in y, then rotated)
LED0805-R-RD
  rect 1x1.399 smd: 1(1.05,0) 2(-1.05,0)
LED-SEG-TH_12P-L30.0-W14.0-P2.54-LS10.2
  rect 1.8x1.8 hole 0.8: 1(-6.36,-5.125)
  round 1.6 hole 0.8: 2(-3.82,-5.125) 3(-1.28,-5.125) 4(1.26,-5.125) 5(3.8,-5.125) 6(6.34,-5.125) 7(6.36,5.125) 8(3.82,5.125) 9(1.28,5.125) 10(-1.26,5.125) 11(-3.8,5.125) 12(-6.34,5.125)
R0603
  rect 0.806x0.864 smd: 1(-0.753,0) 2(0.753,0)
SOP-16_L10.0-W3.9-P1.27-LS6.0-BL
  oval 0.56x1.745 smd: 1(-4.445,-2.873) 2(-3.175,-2.873) 3(-1.905,-2.873) 4(-0.635,-2.873) 5(0.635,-2.873) 6(1.905,-2.873) 7(3.175,-2.873) 8(4.445,-2.873) 9(4.445,2.873) 10(3.175,2.873) 11(1.905,2.873) 12(0.635,2.873) 13(-0.635,2.873) 14(-1.905,2.873) 15(-3.175,2.873) 16(-4.445,2.873)
SW-TH_4P-L6.0-W6.0-P4.50-LS6.5
  round 1.8 hole 1.2: 1(-3.25,2.25) 2(3.25,2.25) 3(-3.25,-2.25) 4(3.25,-2.25)
USB-AM-TH_AM90
  round 1.6 hole 1: 1(3.5,1) 2(1,1) 3(-1,1) 4(-3.5,1)
  round 3.4 hole 2.6: MH1(6,-1) MH2(-6,-1)
USB-C-SMD_TYPEC-304J-BCP16
  oval 1x2.1 hole 0.6x1.8: 13(-4.325,1.718) 14(4.325,1.718)
  oval 1x1.9 hole 0.6x1.5: 15(-4.325,-2.482) 16(4.325,-2.482)
  rect 0.6x1.15 smd: A1B12(-3.2,2.482) A4B9(-2.4,2.482) B1A12(3.2,2.482) B4A9(2.4,2.482)
  rect 0.3x1.15 smd: A5(-1.25,2.482) A6(-0.25,2.482) A7(0.25,2.482) A8(1.25,2.482) B5(1.75,2.482) B6(0.75,2.482) B7(-0.75,2.482) B8(-1.75,2.482)

## Nets
As in the schematic, except:
+5V: U5.10

Pads without a net: U1 1 2 3 4 5 9 10 11; USB1 MH1 MH2; USB2 A5 A8 B5 B8
